# EasyEDA Pro project AC Power Switch.eprj, schematic Schematic2
Board Name: V3.0.0 Contactor Switch; Create Date: 2026-02-14; Page Name: P1; Project Name: AC Power Switch; Schematic Name: Schematic2; Update Date: 2026-02-14; Company: EasyEDA.com; Page Size: A4; Version: V1.0
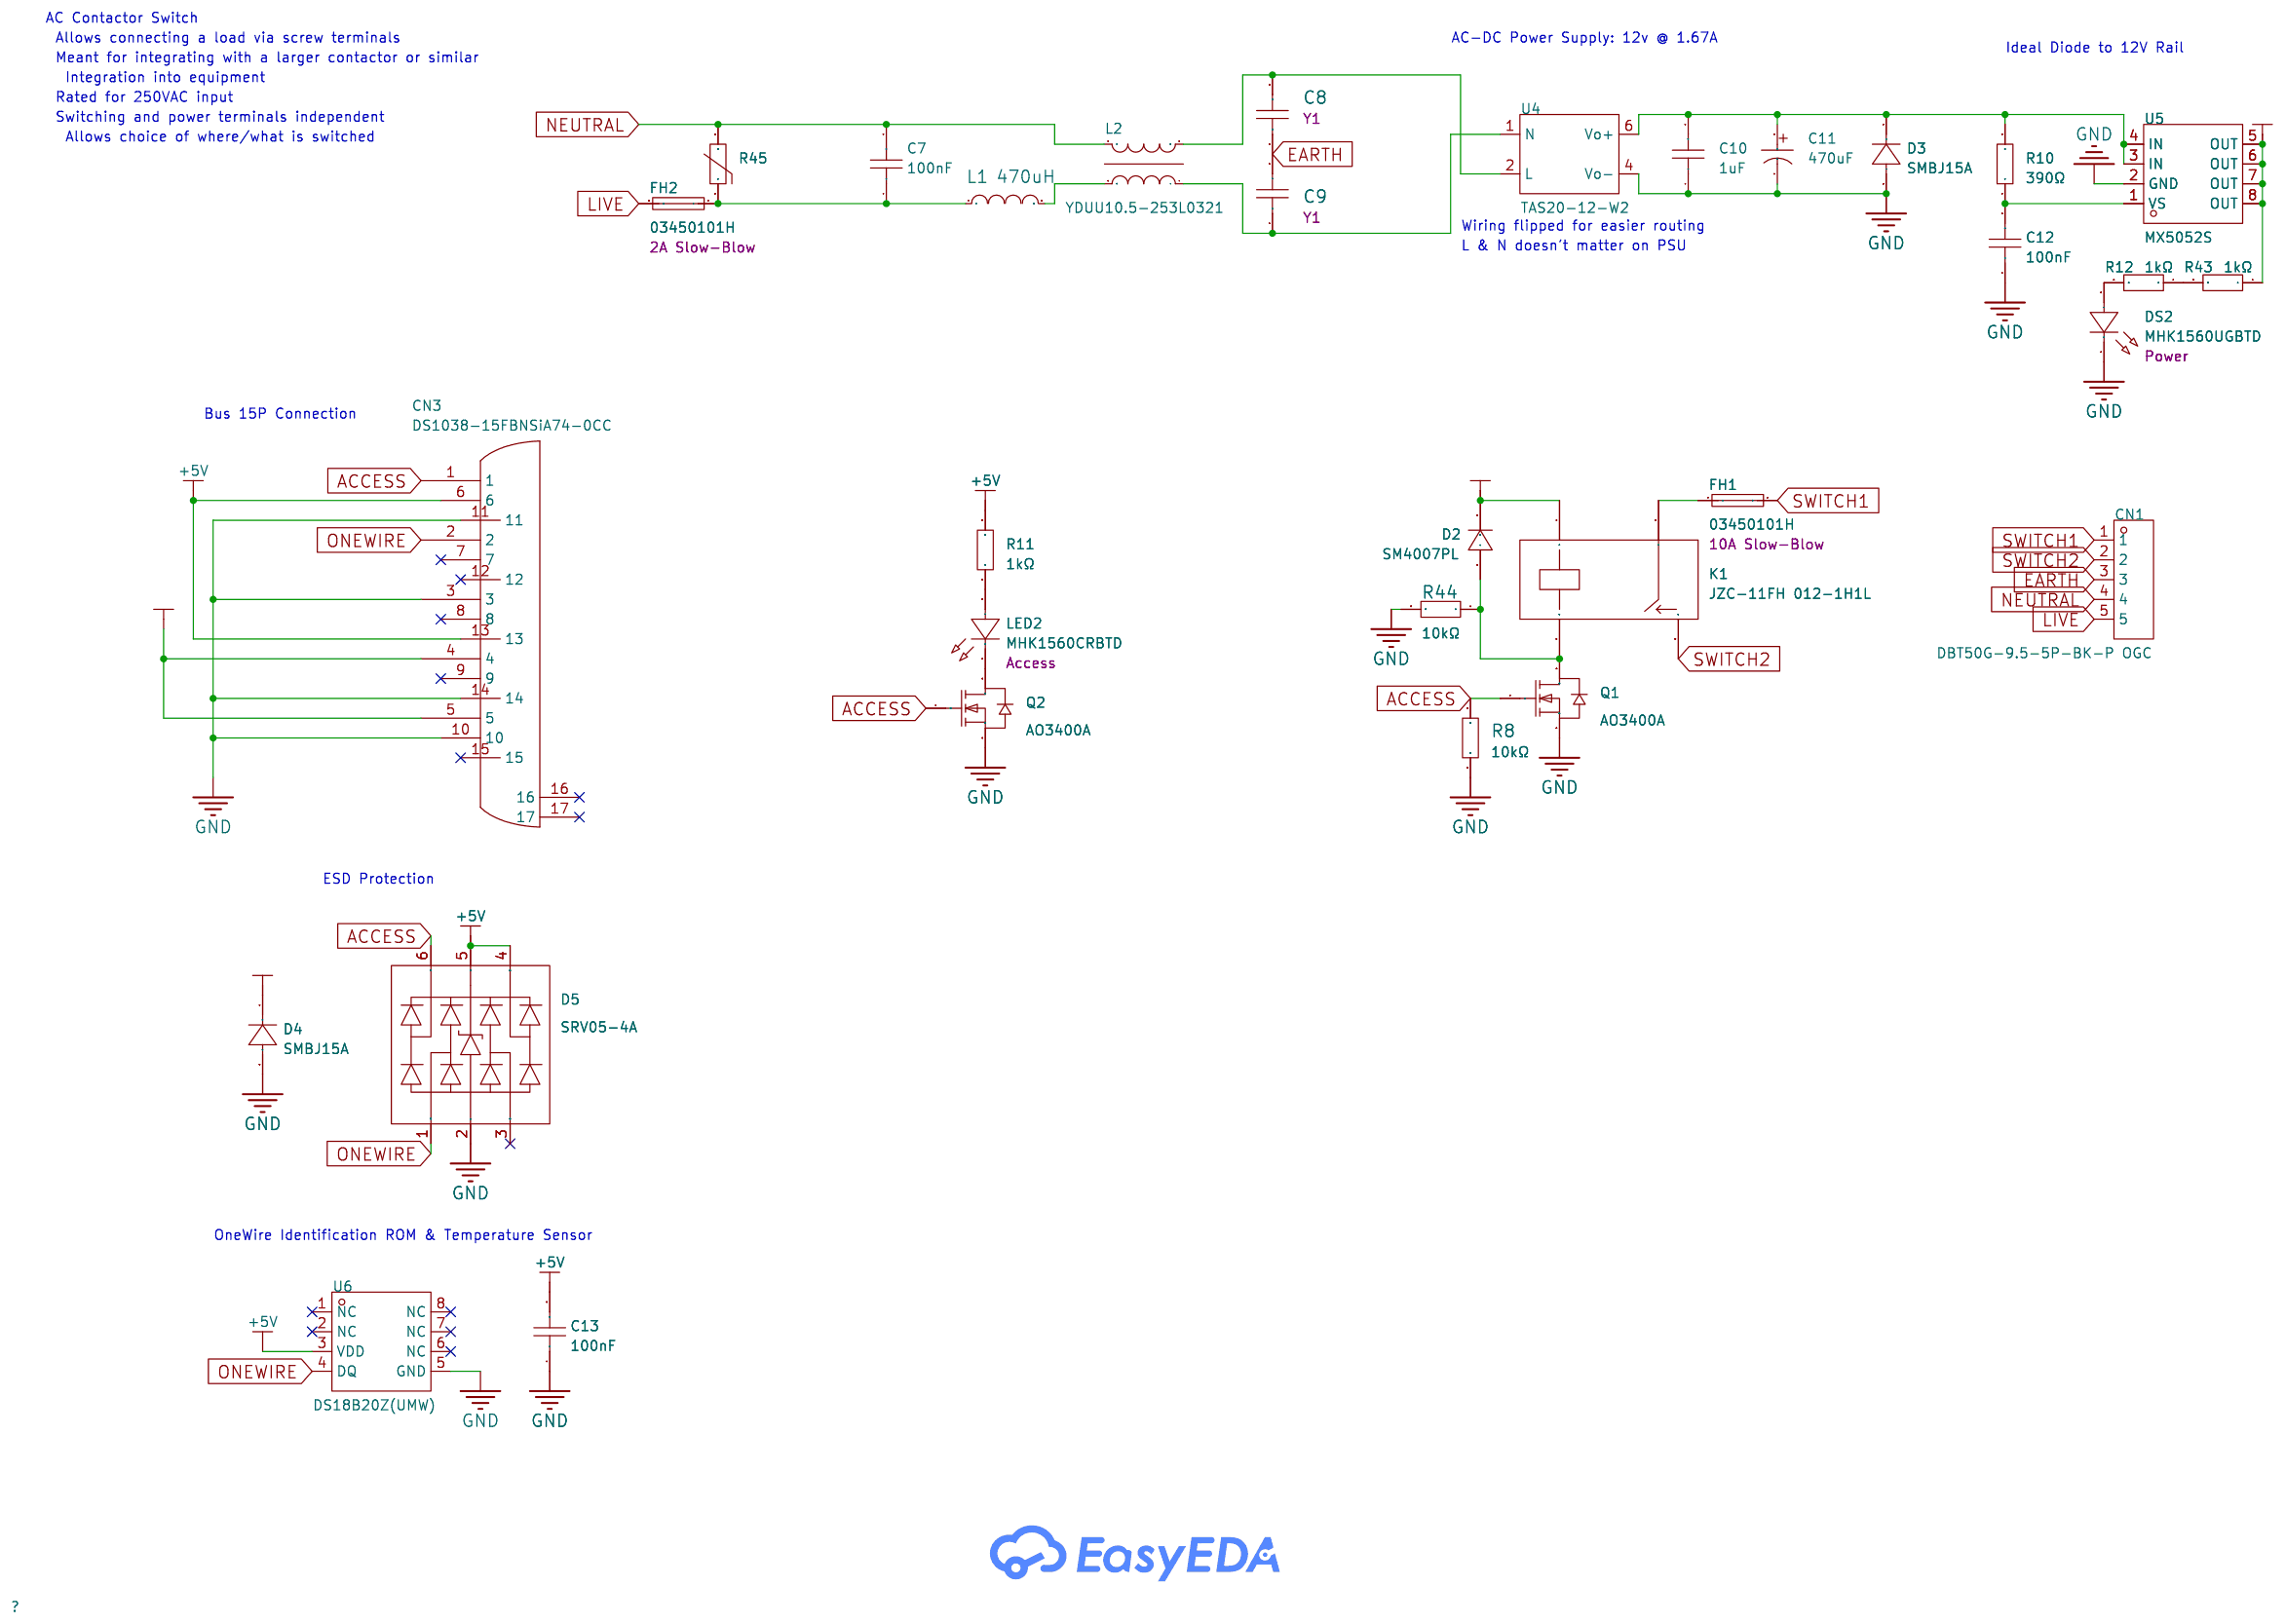
[diagram p4: schematic sheet]

## Parts
C7  100nF  [CAP-TH_L10.0-W5.0-P7.50-D0.6]
C8  1nF  [CAP-TH_L8.5-W5.0-P10.00-D0.6]
C9  1nF  [CAP-TH_L8.5-W5.0-P10.00-D0.6]
C10  1uF  [C0603]
C11  470uF  [CAP-TH_BD10.0-P5.00-D1.0-FD]
C12  100nF  [C0603]
C13  100nF  [C0603]
CN1  DBT50G-9.5-5P-BK-P OGC  [CONN-TH_5P-P9.50_DBT50G-9.5-5P]
CN3  DS1038-15FBNSiA74-0CC  [DSUB-TH_DS1038-15FBNSIA74-0CC]
D2  SM4007PL  [SOD-123F_L2.8-W1.8-LS3.7-RD]
D3  SMBJ15A  [SMB_L4.3-W3.6-LS5.3-RD]
D4  SMBJ15A  [SMB_L4.3-W3.6-LS5.3-RD]
D5  SRV05-4A  [SOT-23-6_L2.9-W1.6-P0.95-LS2.9-BL]
DS2  MHK1560UGBTD  [LED-TH_MHK1560UGBTD]
FH1  03450101H  [03450101H]
FH2  03450101H  [03450101H]
K1  JZC-11FH 012-1H1L  [RELAY-TH_QLRELAY_JZC-11FH-XXX-1H1L]
L1  470uH  [IND-TH_BD9.0-P5.00-D0.7]
L2  YDUU10.5-253L0321  [IND-TH_4P-L19.0-W17.0]
LED2  MHK1560CRBTD  [LED-TH_L12.2-W6.0-P2.54]
Q1  AO3400A  [SOT-23-3_L2.9-W1.3-P1.90-LS2.4-BR]
Q2  AO3400A  [SOT-23-3_L2.9-W1.3-P1.90-LS2.4-BR]
R8  10kΩ  [R0603]
R10  390Ω  [R0805]
R11  1kΩ  [R0603]
R12  1kΩ  [R0603]
R43  1kΩ  [R0603]
R44  10kΩ  [R0603]
R45  210pF@1kHz  [RES-TH_L12.5-W5.1-P7.50-D1.2-S2.20]
U4  TAS20-12-W2  [PWRM-TH_4P-L39.0-W25.0_TAS12-15-W2]
U5  MX5052S  [SOP-8_L4.9-W3.9-P1.27-LS6.0-BL]
U6  DS18B20Z(UMW)  [SOP-8_L4.9-W3.9-P1.27-LS6.0-BL]

## Library data of the parts
C7 = PX104K2C0702: LCSC Part Name: 等级:X2 100nF ±10% 310V 350V 380V; Supplier Part: C2693793; Manufacturer: KYET(科雅); Supplier Footprint: 插件,P=7.5mm; JLCPCB Part Class: Extended Part; Datasheet: https://item.szlcsc.com/datasheet/PX104K2C0702/2809868.html; Supplier: LCSC; Tolerance: ±10%; Voltage(AC): 310V；380V；350V; Ratings: X2; Operating Temperature: -40℃~+110℃
C8 C9 = VY1102M31Y5UC63V0: LCSC Part Name: 等级:X1,Y1 1nF ±20% 760V; Supplier Part: C1620957; Manufacturer: VISHAY(威世); Supplier Footprint: 插件,P=10mm; JLCPCB Part Class: Extended Part; Datasheet: https://item.szlcsc.com/datasheet/VY1102M31Y5UC63V0/1711803.html; Supplier: LCSC; Tolerance: ±20%; Voltage(AC): 760V; Ratings: Y1; Operating Temperature: -40℃~+125℃
C10 = CL10A105KB8NNNC: LCSC Part Name: 1uF ±10% 50V; Supplier Part: C15849; Manufacturer: SAMSUNG(三星); Supplier Footprint: 0603; JLCPCB Part Class: Basic Part; Datasheet: https://item.szlcsc.com/datasheet/CL10A105KB8NNNC/16531.html; Supplier: LCSC; Tolerance: ±10%; Voltage Rating: 50V; Temperature Coefficient: X5R
C11 = KM477M025G13RR0VH2FP0: LCSC Part Name: 470uF ±20% 25V; Supplier Part: C44594; Manufacturer: Chengx(承兴); Supplier Footprint: 插件,D10xL13mm; JLCPCB Part Class: Extended Part; Datasheet: https://item.szlcsc.com/datasheet/KM477M025G13RR0VH2FP0/45596.html; Supplier: LCSC; Tolerance: ±20%; Voltage Rating: 25V; Pin Spacing: 5mm; Diameter: 10mm; Height - Seated (Max): 13mm; Lifetime: 2000hrs@105℃
C12 C13 = CC0603KRX7R9BB104: LCSC Part Name: 100nF ±10% 50V; Supplier Part: C14663; Manufacturer: YAGEO(国巨); Supplier Footprint: 0603; Datasheet: https://item.szlcsc.com/datasheet/CC0603KRX7R9BB104/15331.html; Supplier: LCSC; Tolerance: ±10%; Voltage Rating: 50V; Temperature Coefficient: X7R
CN1 = DBT50G-9.5-5P-BK-P OGC: LCSC Part Name: 9.5mm 1x5P 直插 边脚 排数:1 每排P数:5; Supplier Part: C395961; Manufacturer: DORABO(地博电气); Supplier Footprint: 插件,P=9.5mm; JLCPCB Part Class: Extended Part; Datasheet: https://item.szlcsc.com/datasheet/DBT50G-9.5-5P-BK-P%2520OGC/376708.html; Supplier: LCSC; Barrier Type: With Cover Plate; Pitch: 9.5mm; Number of Positions or Pins: 1x5P; Mounting Type: Straight; Pin Location: Side Mount; Number of Pins: 5P; Number of Rows: 1; Number of PINs Per Row: 5; Current Rating: 32A; Voltage Rating (Max): 750V; Wire Gauge - AWG: 12~22; Wire Gauge - mm2: 4; Operating Temperature: -40℃~+105℃; Color: Black
CN3 = DS1038-15FBNSiA74-0CC: Connector Type:High Density D-Sub Gender:Female Number of Pins:15P Mounting Type:Right Angle Number of Rows:3 Current Rating-Signal:3A Current Rating-Power:- Voltage Rating:- Color:Black Operating Temperature:-40℃~+105℃ Operating Temperature:-40℃~+105℃; LCSC Part Name: 黑色 1000/盒 D-Sub 母 P数:15P; Supplier Part: C75754; Manufacturer: CONNFLY; Supplier Footprint: 弯插; JLCPCB Part Class: Extended Part; Datasheet: https://item.szlcsc.com/datasheet/DS1038-15FBNSiA74-0CC/76880.html; Supplier: LCSC; Connector Type: High Density D-Sub; Gender: Female; Number of Pins: 15P; Mounting Type: Right Angle; Number of Rows: 3; Current Rating-Signal: 3A; Color: Black; Operating Temperature: -40℃~+105℃
D2 = SM4007PL_C64898: LCSC Part Name: 1kV 1A; Supplier Part: C64898; Manufacturer: MDD(辰达半导体); Supplier Footprint: SOD-123FL; Datasheet: https://item.szlcsc.com/datasheet/SM4007PL/65968.html; Supplier: LCSC; Diode Configuration: Independent; Voltage - Forward(Vf@If): 1.1V@1A; Voltage - DC Reverse(Vr): 1kV; Current - Rectified: 1A; Reverse Leakage Current (Ir): 10uA@1kV; Non-Repetitive Peak Forward Surge Current: 25A; Operating Junction Temperature Range: -55℃~+150℃
D3 D4 = SMBJ15A_C19077569: LCSC Part Name: 单向TVS 15V截止 峰值浪涌电流：24.59A@10/1000us; Supplier Part: C19077569; Manufacturer: R+O(宏嘉诚); Supplier Footprint: DO-214AA(SMB); JLCPCB Part Class: Extended Part; Datasheet: https://item.szlcsc.com/datasheet/SMBJ15A/20275654.html; Supplier: LCSC; Polarity: Unidirectional; Reverse Stand-Off Voltage (Vrwm): 15V; Clamping Voltage: 24.4V; Peak Pulse Current (Ipp): 24.59A@10/1000us; Peak Pulse Power Dissipation (Ppp): 600W@10/1000us; Voltage - Breakdown: 18.5V; Reverse Leakage Current (Ir): 5uA; Operating Temperature: -55℃~+150℃; level of protection: IEC 61000-4-2; Type: TVS
D5 = SRV05-4A_C20615829: LCSC Part Name: 丝印:V05 单向ESD 5V截止 峰值浪涌电流：4A@8/20us; Supplier Part: C20615829; Manufacturer: R+O(宏嘉诚); Supplier Footprint: SOT-23-6L; JLCPCB Part Class: Extended Part; Datasheet: https://item.szlcsc.com/datasheet/SRV05-4A/21980004.html; Supplier: LCSC; Polarity: Unidirectional; Reverse Stand-Off Voltage (Vrwm): 5V; Clamping Voltage: 15V; Peak Pulse Current (Ipp): 4A@8/20us; Peak Pulse Power Dissipation (Ppp): 80W@8/20us; Voltage - Breakdown: 6V; Reverse Leakage Current (Ir): 5uA; Operating Temperature: -55℃~+155℃; level of protection: IEC 61000-4-5；IEC 61000-4-2; Type: ESD; Junction Capacitance: 0.5pF；1pF
DS2 = MHK1560UGBTD: Emitted Color:Emerald Forward Voltage (VF):1.75V~2.2V Forward Voltage (VF):1.75V~2.2V Forward Current:20mA Dominant Wavelength:520nm Dominant Wavelength:520nm Lens Color:雾状绿透镜 Luminous Intensity:1000mcd Luminous Intensity:1000mcd Viewing Angle:85° Operati; LCSC Part Name: 1560直插单灯翠绿色光; Supplier Part: C7470833; Manufacturer: MEIHUA(美华); Supplier Footprint: 插件,P=2.54mm; JLCPCB Part Class: Extended Part; Datasheet: https://atta.szlcsc.com/upload/public/pdf/source/20231114/0151DB1F997DCF286213A722D08B4BAA.pdf; Supplier: LCSC; Emitted Color: Emerald; Forward Voltage (VF): 1.75V~2.2V; Forward Current: 20mA; Dominant Wavelength: 520nm; Lens Color: 雾状绿透镜; Luminous Intensity: 1000mcd; Viewing Angle: 85°; Operating Temperature: -40℃~+85℃; Note: Power
FH1 = 03450101H: LCSC Part Name: 20A 600V; Supplier Part: C206934; Manufacturer: Littelfuse(美国力特); Datasheet: https://item.szlcsc.com/datasheet/03450101H/208053.html; Supplier: LCSC; Number of Circuits: 1; Voltage Rating: 600V; Current Rating: 20A; Fuse Type: Cylindrical; Fuse Diameter (φD): 6.35mm; Fuse Length: 32mm; Note: 10A Slow-Blow
FH2 = 03450101H: LCSC Part Name: 20A 600V; Supplier Part: C206934; Manufacturer: Littelfuse(美国力特); Datasheet: https://item.szlcsc.com/datasheet/03450101H/208053.html; Supplier: LCSC; Number of Circuits: 1; Voltage Rating: 600V; Current Rating: 20A; Fuse Type: Cylindrical; Fuse Diameter (φD): 6.35mm; Fuse Length: 32mm; Note: 2A Slow-Blow
K1 = JZC-11FH 012-1H1L: LCSC Part Name: 12V 20A 一组常开:1A(单刀单掷-常开); Supplier Part: C22384972; Manufacturer: QLRELAY(群力); Supplier Footprint: 插件,18.4x10.2mm; JLCPCB Part Class: Extended Part; Datasheet: https://item.szlcsc.com/datasheet/JZC-11FH%2520012-1H1L/23933064.html; Supplier: LCSC; Coil Voltage: 12V; Contact Form: 1 Set Normally Open: 1A (SPST NO); Number of Pins: 4; Contact Rating: 20A@125VAC；18A@277VAC; Switching Voltage(Max): 277V@AC; Coil Rated Power: 200mW; Contact Material: Silver Alloy; Switching Current(Max): 20A; Coil Type: Non-Polarized - Single Coil; Coil Resistance: 720Ω; Contact Resistance: 100mΩ; Operate Time: 10ms; Release Time: 10ms; Operating Temperature: -40℃~+85℃
L1 = PK0810-471MB: LCSC Part Name: 470uH ±20%; Supplier Part: C400319; Manufacturer: SXN(顺翔诺); Supplier Footprint: 插件,D10xL13mm; JLCPCB Part Class: Extended Part; Datasheet: https://item.szlcsc.com/datasheet/PK0810-471MB/384150.html; Supplier: LCSC; Tolerance: ±20%; Current Rating: 420mA; DC Resistance(DCR): 800mΩ; Type: Unshielded Inductor
L2 = YDUU10.5-253L0321: LCSC Part Name: UU10.5 25mH @1KHz; Supplier Part: C5200263; Manufacturer: YJYCOIN(益嘉源); Supplier Footprint: 插件,19x17mm; JLCPCB Part Class: Extended Part; Datasheet: https://item.szlcsc.com/datasheet/YDUU10.5-253L0321/5887401.html; Supplier: LCSC; Number of Lines: 2; Inductance @ Frequency: 25mH@1KHz; Voltage Withstand: 1.5kV@AC
LED2 = MHK1560CRBTD: LCSC Part Name: 1560直插单灯红色光; Supplier Part: C7470835; Manufacturer: MEIHUA(美华); Supplier Footprint: 插件,P=2.54mm; JLCPCB Part Class: Extended Part; Datasheet: https://item.szlcsc.com/datasheet/MHK1560CRBTD/8521940.html; Supplier: LCSC; Illumination Color: Red; Voltage - Forward(Vf): 1.75V~2.2V; Power(Watts): 80mW; Forward Current: 20mA; Wavelength - Dominant: 632nm; Lens Color: Diffused Red Lens; Luminous Intensity: 50mcd; Viewing Angle: 85°; Operating Temperature: -40℃~+85℃; Note: Access
Q1 Q2 = AO3400A_C20917: LCSC Part Name: 1个N沟道 耐压:30V 电流:5.7A; Supplier Part: C20917; Manufacturer: AOS; Supplier Footprint: SOT-23-3L; Datasheet: https://item.szlcsc.com/datasheet/AO3400A/21629.html; Supplier: LCSC; Drain to Source Voltage: 30V; RDS(on): 48mΩ@2.5V; Gate Threshold Voltage (Vgs(th)): 1.45V@250uA; Gate Charge(Qg): 7nC@10V; Input Capacitance(Ciss): 630pF@15V; Operating Temperature: -55℃~+150℃@(Tj); Type: N-Channel
R8 R44 = 0603WAF1002T5E: LCSC Part Name: 厚膜电阻 10kΩ ±1% 100mW; Supplier Part: C25804; Manufacturer: UNI-ROYAL(厚声); Supplier Footprint: 0603; JLCPCB Part Class: Basic Part; Datasheet: https://item.szlcsc.com/datasheet/0603WAF1002T5E/26547.html; Supplier: LCSC; Type: Thick Film Resistor; Tolerance: ±1%; Power(Watts): 100mW; Voltage-Supply(Max): 75V; Temperature Coefficient: ±100ppm/℃; Operating Temperature: -55℃~+155℃
R10 = 0805W8F3900T5E: Type:Thick Film Resistor Resistance:390Ω Tolerance:±1% Tolerance:±1% Power(Watts):125mW Voltage-Supply(Max):150V Temperature Coefficient:±100ppm/℃ Temperature Coefficient:±100ppm/℃ Operating Temperature:-55℃~+155℃ Operating Temperature:-55℃~+155℃; LCSC Part Name: 390Ω ±1% 125mW 厚膜电阻; Supplier Part: C17655; Manufacturer: UNI-ROYAL(厚声); Supplier Footprint: 0805; Datasheet: https://item.szlcsc.com/datasheet/0805W8F3900T5E/18343.html; Supplier: LCSC; Type: Thick Film Resistor; Tolerance: ±1%; Power(Watts): 125mW; Voltage-Supply(Max): 150V; Temperature Coefficient: ±100ppm/℃; Operating Temperature: -55℃~+155℃
R11 R12 R43 = 0603WAF1001T5E: LCSC Part Name: 1kΩ ±1% 100mW 厚膜电阻; Supplier Part: C21190; Manufacturer: UNI-ROYAL(厚声); Supplier Footprint: 0603; Datasheet: https://item.szlcsc.com/datasheet/0603WAF1001T5E/21904.html; Supplier: LCSC; Type: Thick Film Resistor; Tolerance: ±1%; Power(Watts): 100mW; Voltage-Supply(Max): 75V; Temperature Coefficient: ±100ppm/℃; Operating Temperature: -55℃~+155℃
R45 = VDR-10D471K: LCSC Part Name: 钳位电压775V 67焦耳 插件压敏电阻; Supplier Part: C316609; Manufacturer: VDR(嵩隆); Supplier Footprint: 插件,P=7.5mm; JLCPCB Part Class: Extended Part; Datasheet: https://item.szlcsc.com/datasheet/VDR-10D471K/298277.html; Supplier: LCSC; Varistor Voltage: 423V~517V; Clamping Voltage: 775V; Maximum DC Volts: 385V; Maximum AC Volts: 300V; Peak Current: 2.5kA; Energy: 67J; Rated Wattage: 400mW
U4 = TAS20-12-W2: LCSC Part Name: 小体积AC-DC电源模块; Supplier Part: C39846906; Manufacturer: TDPOWER(腾达电源); Supplier Footprint: 插件,39x25mm; JLCPCB Part Class: Extended Part; Datasheet: https://item.szlcsc.com/datasheet/TAS20-12-W2/41578643.html; Supplier: LCSC; Conversion Type: AC/DC-DC; Number of Outputs: 1; Voltage - Input(DC): 100V~370V; Voltage - Input(AC): 85VAC~265VAC; Output Voltage: 12V; Output Voltage Accuracy: ±2%; Output Current(Max): 1.67A; Output Power: 20W; Quiescent Dissipation: 0.15W; Conversion Efficiency: 88%; Ripple Noise: 100mVp-p; Capacitive Load(Max): 3300uF; Features: Over Current Protection；Short Circuit Protection; Isolation Voltage(Vrms): 2.5kV; Length: 39mm; Width: 25mm; Height: 21mm; Switching Frequency: 100kHz
U5 = MX5052S: LCSC Part Name: 集成MOS Oring控制器; Supplier Part: C5875696; Manufacturer: Wuxi Maxinmicro(无锡明芯微); Supplier Footprint: SOP-8; JLCPCB Part Class: Extended Part; Datasheet: https://item.szlcsc.com/datasheet/MX5052S/6809525.html; Supplier: LCSC
U6 = DS18B20Z(UMW): LCSC Part Name: 温度传感器; Supplier Part: C695837; Manufacturer: UMW(友台半导体); Supplier Footprint: SOIC-8; JLCPCB Part Class: Extended Part; Datasheet: https://atta.szlcsc.com/upload/public/pdf/source/20241210/329D6A12FB6ADF2EBB286F6D44242ED4.pdf; Supplier: LCSC; Resolution: ±0.4℃; Supply Voltage: 2.5V~5.5V

## Nets
+5V: C13.2 CN3.6 CN3.13 D5.4(I/O) D5.5(VP) R11.2 U6.3(VDD)
+12V: CN3.4 CN3.5 D2.1(C) D4.1(K) K1.1 R43.1 U5.5(OUT) U5.6(OUT) U5.7(OUT) U5.8(OUT)
GND: C10.1 C11.2 C12.1 C13.1 CN3.3 CN3.10 CN3.11 CN3.14 D3.2(A) D4.2(A) D5.2(VN) DS2.1(K) Q1.2(S) Q2.2(S) R8.1 R44.2 U4.4(Vo-) U5.2(GND) U6.5(GND)
ACCESS: CN3.1 D5.6(I/O) Q1.1(G) Q2.1(G) R8.2
EARTH: C8.1 C9.2 CN1.3
LIVE: CN1.5 FH2.2
NEUTRAL: C7.2 CN1.4 L2.1 R45.2
ONEWIRE: CN3.2 D5.1(I/O) U6.4(DQ)
SWITCH1: CN1.1 FH1.2
SWITCH2: CN1.2 K1.3
$1N1091: C9.1 L2.4 U4.1(N)
$1N1092: C8.2 L2.3 U4.2(L)
$1N1094: L1.2 L2.2
$1N1096: C7.1 FH2.1 L1.1 R45.1
$1N1098: C10.2 C11.1 D3.1(K) R10.2 U4.6(Vo+) U5.3(IN) U5.4(IN)
$1N1102: DS2.2(A) R12.2
$1N1103: R12.1 R43.2
$1N1104: C12.2 R10.1 U5.1(VS)
$1N1155: FH1.1 K1.4
$1N1301: D2.2(A) K1.2 Q1.3(D) R44.1
$1N2019: LED2.2(A) R11.1
$1N2020: LED2.1(K) Q2.3(D)

Not connected (* = marked no-connect by the designer): CN3 7* 8* 9* 12* 15* 16* 17*; D5 3(I/O)*; U6 1(NC)* 2(NC)* 6(NC)* 7(NC)* 8(NC)*

## Notes on the sheet
- AC Contactor Switch
- Allows connecting a load via screw terminals
- AC-DC Power Supply: 12v @ 1.67A
- Meant for integrating with a larger contactor or similar
- Ideal Diode to 12V Rail
- Integration into equipment
- Rated for 250VAC input
- Switching and power terminals independent
- Allows choice of where/what is switched
- Wiring flipped for easier routing
- L & N doesn't matter on PSU
- Bus 15P Connection
- ESD Protection
- OneWire Identification ROM & Temperature Sensor
